# EAGLE design PM_proto_2-alt (EAGLE 9.0.0)
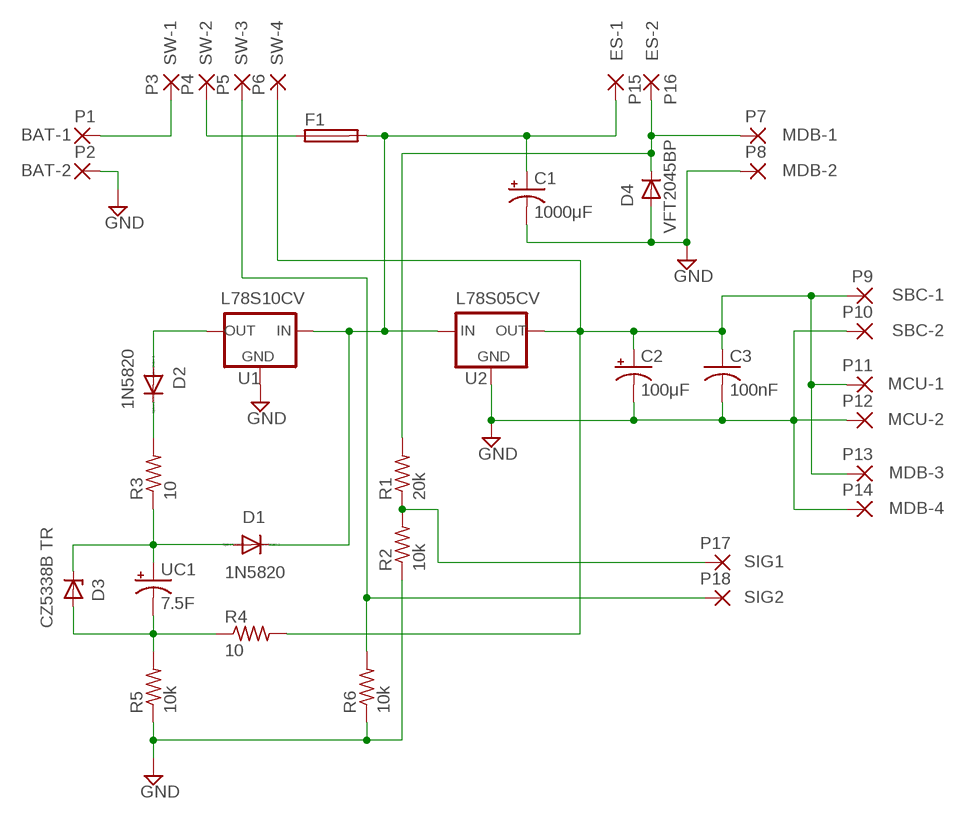
[diagram p0: schematic, sheet 1]

## Parts
C1  1000μF  CPOL-USE7.5-16  [E7,5-16]
C2  100μF  CPOL-USE2,5-6E  [E2,5-6E]
C3  100nF  C-US050-024X044  [C050-024X044]
D1  1N5820  1N4004  [DO41-10]
D2  1N5820  1N4004  [DO41-10]
D3  CZ5338B TR  1N4728  [DO41Z10]
D4  VFT2045BP  [VFT2045BP]
F1  0297015FUSE  [0297015HOLDER]
P1  BAT-1  1,6/0,8  [1,6/0,8]
P2  BAT-2  1,6/0,8  [1,6/0,8]
P3  SW-1  1,6/0,8  [1,6/0,8]
P4  SW-2  1,6/0,8  [1,6/0,8]
P5  SW-3  1,6/0,8  [1,6/0,8]
P6  SW-4  1,6/0,8  [1,6/0,8]
P7  MDB-1  1,6/0,8  [1,6/0,8]
P8  MDB-2  1,6/0,8  [1,6/0,8]
P9  SBC-1  1,6/0,8  [1,6/0,8]
P10  SBC-2  1,6/0,8  [1,6/0,8]
P11  MCU-1  1,6/0,8  [1,6/0,8]
P12  MCU-2  1,6/0,8  [1,6/0,8]
P13  MDB-3  1,6/0,8  [1,6/0,8]
P14  MDB-4  1,6/0,8  [1,6/0,8]
P15  ES-1  1,6/0,8  [1,6/0,8]
P16  ES-2  1,6/0,8  [1,6/0,8]
P17  SIG1  1,6/0,8  [1,6/0,8]
P18  SIG2  1,6/0,8  [1,6/0,8]
R1  20k  R-US_0204/7  [0204/7]
R2  10k  R-US_0204/7  [0204/7]
R3  10  TNP10SC10R0FE  [TNP10SC10R0FE]
R4  10  TNP10SC10R0FE  [TNP10SC10R0FE]
R5  10k  R-US_0204/7  [0204/7]
R6  10k  R-US_0204/7  [0204/7]
U1  L78S10CV  78XXS  [78XXS]
U2  L78S05CV  78XXS  [78XXS]
UC1  7.5F  SCMT32D755MRBB0  [SCMT32D755MRBB0]

## Nets
5VPWR: C2.+ C3.1 P6.1(P) P9.1(P) P11.1(P) P13.1(P) R4.2 U2.OUT
BATT_1: P1.1(P) P3.1(P)
BATT_2: F1.1 F1.2 P4.1(P)
BATT_3: C1.+ D1.C F1.3 F1.4 P15.1(P) U1.IN U2.IN
BATT_4: D4.1(C) P7.1(P) P16.1(P) R1.2
CAP_NEG: D3.A R4.1 R5.2 UC1.2(-)
CAP_POS: D1.A D3.C R3.1 UC1.1(+)
GND: C1.- C2.- C3.2 D4.2(A) P2.1(P) P8.1(P) P10.1(P) P12.1(P) P14.1(P) R2.1 R5.1 R6.1 U1.GND U2.GND
N$2: D2.A U1.OUT
N$3: D2.C R3.2
ON_SENSE: P5.1(P) P18.1(P) R6.2
V_SENSE: P17.1(P) R1.1 R2.2

## Library data of the parts
C1 C2 = rcl:CPOL-US: POLARIZED CAPACITOR, American symbol; SPICEPREFIX: C
C3 = rcl:C-US: CAPACITOR, American symbol; SPICEPREFIX: C
D1 D2 = diode:1N4004: DIODE general purpose rectifier, 1 A
D3 = diode:1N4728: Z DIODE 3.3 V, 1W, 5 percent
D4 = rasm_parts:VFT2045BP: Trench MOS Barrier Schottky Rectifier. 20A 0.51V.
F1 = rasm_parts:0297015FUSE: MINI Blade Fuse 0297xxx
P1-P18 = wirepad:1,6/0,8: THROUGH-HOLE PAD
R1 R2 R5 R6 = rcl:R-US_: RESISTOR, American symbol; SPICEPREFIX: R
R3 R4 = rasm_parts:TNP10SC10R0FE
U1 = v-reg:78XXS: VOLTAGE REGULATOR
U2 = v-reg:78XXS: VOLTAGE REGULATOR; SPICEPREFIX: J
UC1 = rasm_parts:SCMT32D755MRBB0: 5.4V 7.5F supercapacitor/ultracapacitor.

## Board
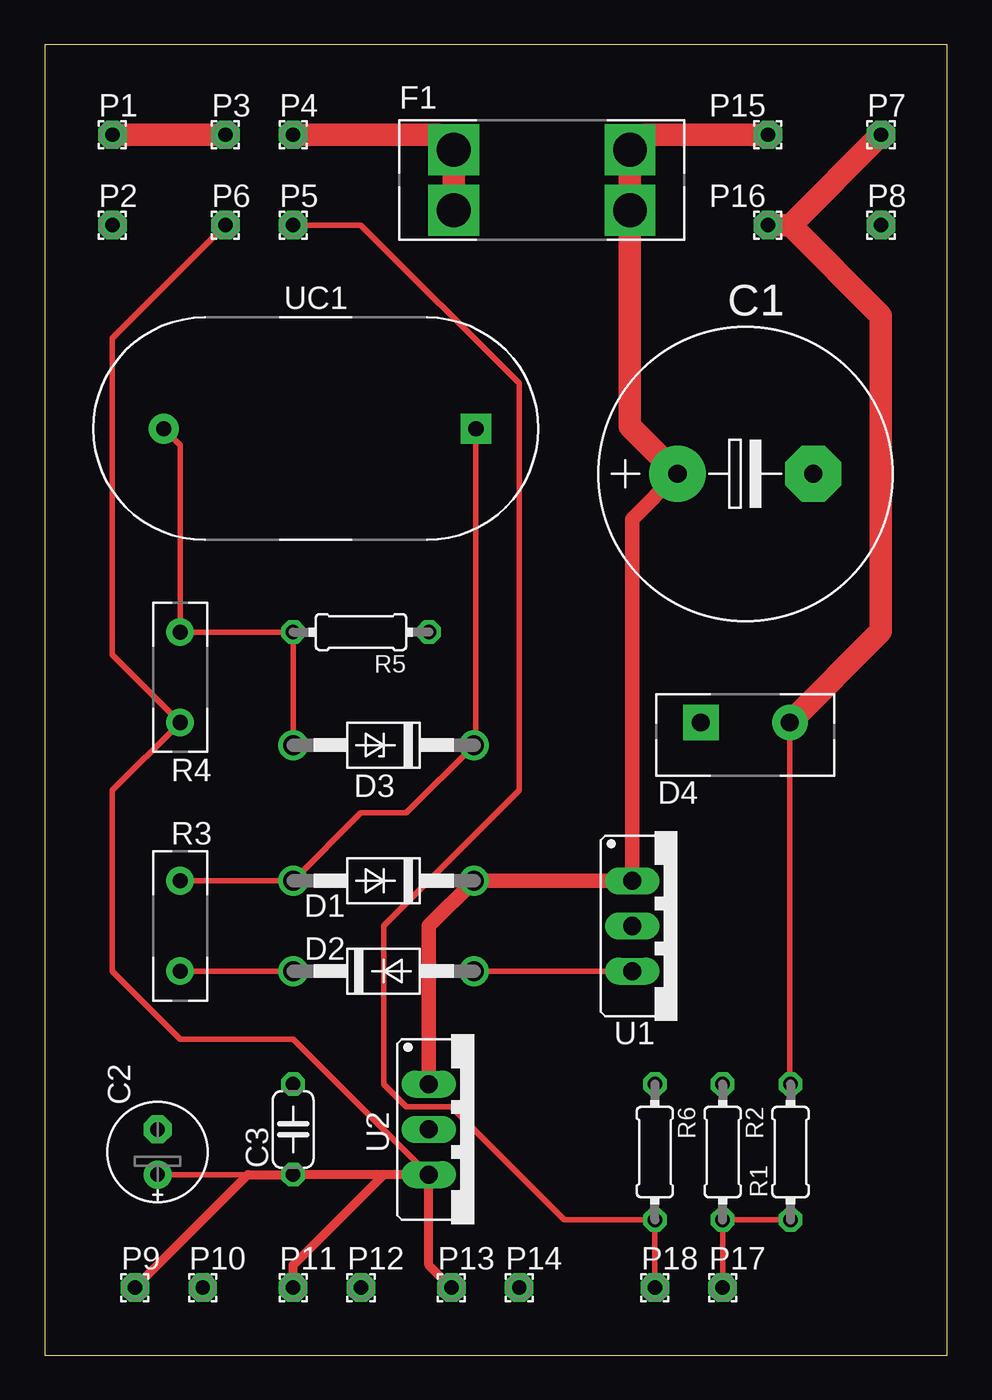
[diagram p1: board, top side]
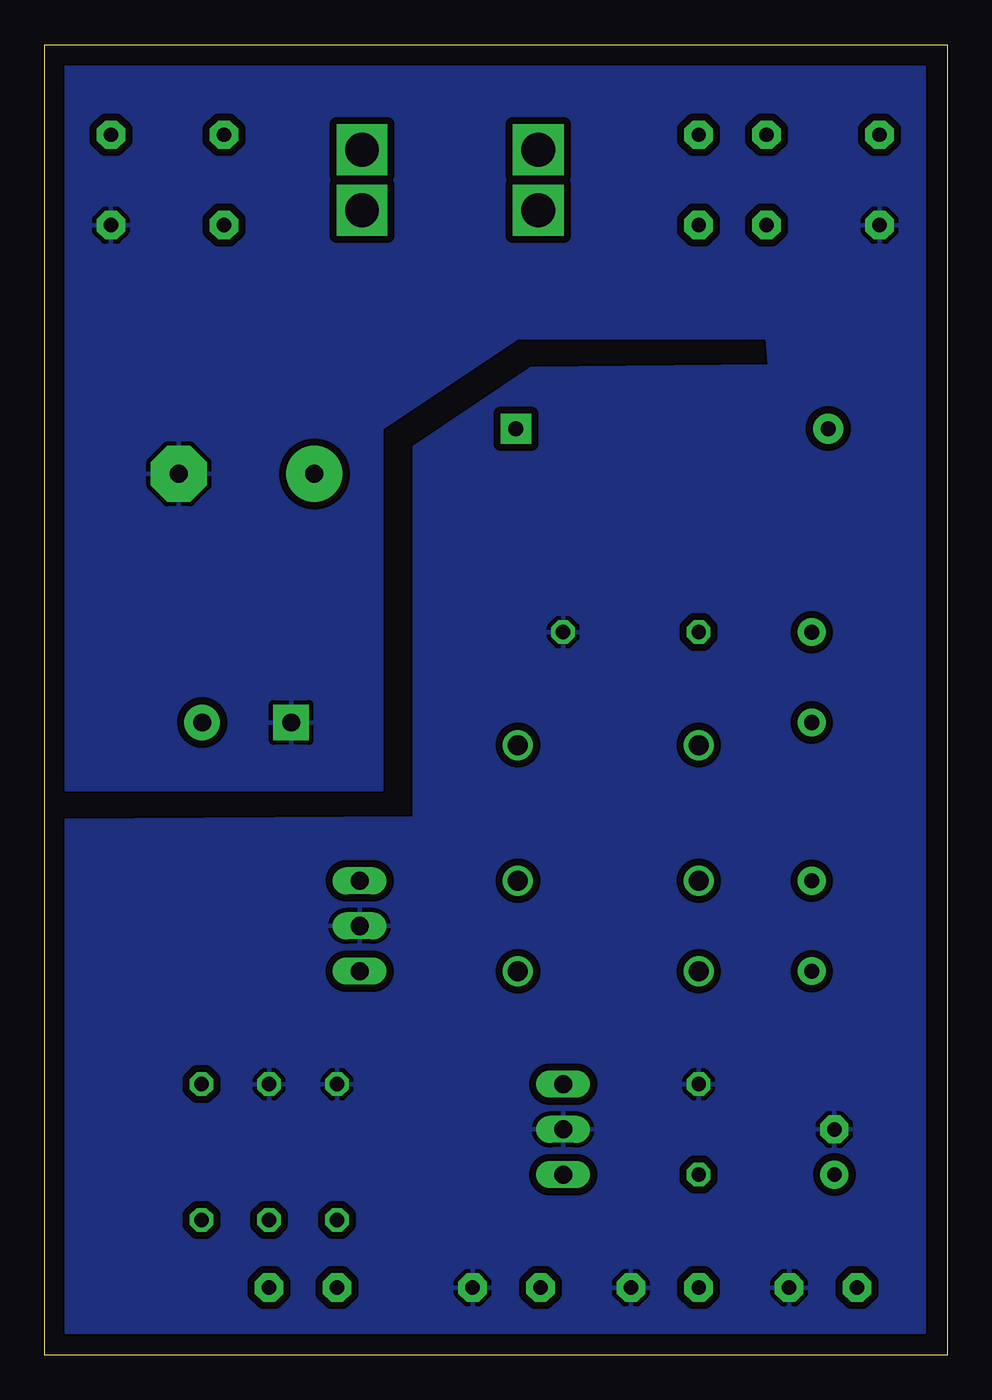
[diagram p2: board, bottom side, seen from below]

Size 50.72 x 73.65 mm. Coordinates in mm from the lower left corner, seen from the top.
Outline: 0,0 50.72,0 50.72,73.65 0,73.65 0,0
Copper layers (1*16): Top 0.035mm / dielectric 1.5mm / Bottom 0.035mm
Design rules "default": minimum track width 6mil, minimum drill 0.35mm, track to track 6mil, track to pad 6mil, pad to pad 6mil, via to via 6mil, smd to smd 6mil, copper to edge 40mil, drill to drill 6mil, minimum pad ring 10mil, minimum via ring 8mil, stop-mask expansion 4mil, vias tented up to drill 0mil, thermal gap 10mil

### Footprints (pad centres in the part's own frame; a part is rotated, then mirrored left to right if it is on the bottom)
E7,5-16 = drill 1.016 pad 3.15: + -3.81,0 | drill 1.016 pad 3.15 octagon: - 3.81,0
E2,5-6E = drill 0.813 pad 1.575: + -1.27,0 | drill 0.813 pad 1.575 octagon: - 1.27,0
C050-024X044 = drill 0.813 octagon: 1 -2.54,0; 2 2.54,0
DO41-10 = drill 1.118: A 5.08,0; C -5.08,0
DO41Z10 = drill 1.118: A 5.08,0; C -5.08,0
VFT2045BP = drill 1 pad 2: 1 -2.5,0 | drill 1 pad 2 square: 2 2.5,0
0297015HOLDER = drill 1.9 pad 2.6 square: 1 -4.95,1.7; 2 -4.95,-1.7; 3 4.95,1.7; 4 4.95,-1.7
1,6/0,8 = drill 0.813 pad 1.6 octagon: 1 0,0
0204/7 = drill 0.813 octagon: 1 -3.81,0; 2 3.81,0
TNP10SC10R0FE = drill 0.85 pad 1.55: 1 -2.54,0; 2 2.54,0
78XXS = drill 1.016 long: GND 0,-2.54; IN -2.54,-2.54; OUT 2.54,-2.54
SCMT32D755MRBB0 = drill 0.85 pad 1.7 square: 1 -9,0 | drill 0.85 pad 1.7: 2 8.54,0

### Placement (x,y rotation side)
C1  39.37,49.53 0 top
C2  6.35,11.43 90 top
C3  13.97,12.7 90 top
D1  19.05,26.67 180 top
D2  19.05,21.59 0 top
D3  19.05,34.29 180 top
D4  39.37,35.56 180 top
F1  27.94,66.04 0 top
P1  3.81,68.58 0 top
P2  3.81,63.5 0 top
P3  10.16,68.58 0 top
P4  13.97,68.58 0 top
P5  13.97,63.5 0 top
P6  10.16,63.5 0 top
P7  46.99,68.58 0 top
P8  46.99,63.5 0 top
P9  5.08,3.81 0 top
P10  8.89,3.81 0 top
P11  13.97,3.81 0 top
P12  17.78,3.81 0 top
P13  22.86,3.81 0 top
P14  26.67,3.81 0 top
P15  40.64,68.58 0 top
P16  40.64,63.5 0 top
P17  38.1,3.81 0 top
P18  34.29,3.81 0 top
R1  41.91,11.43 90 top
R2  38.1,11.43 270 top
R3  7.62,24.13 270 top
R4  7.62,38.1 270 top
R5  17.78,40.64 180 top
R6  34.29,11.43 270 top
U1  35.56,24.13 270 top
U2  24.13,12.7 270 top
UC1  15.24,52.07 180 top

### Tracks (layer width: path | path; a pad name or v marks a point on that pad's centre or on a via)
5VPWR
  Top 0.305: P6.1 3.81,57.15 3.81,39.37 R4.2 3.81,31.75 3.81,21.59 7.62,17.78 13.97,17.78 U2.OUT | C2.+ 11.43,10.16
  Top 0.508: 19.05,10.16 U2.OUT 21.59,5.08 P13.1 | 19.05,10.16 C3.1 11.43,10.16 P9.1 | P11.1 13.97,5.08 19.05,10.16
BATT_1
  Top 1.27: P3.1 P1.1
BATT_2
  Top 1.27: F1.2 F1.1 22.15,68.58 P4.1
BATT_3
  Top 0.305: F1.4 32.89,63.37
  Top 0.813: C1.+ 33.02,46.99 U1.IN D1.C 21.59,24.13 U2.IN
  Top 1.27: P15.1 33.73,68.58 F1.3 F1.4 32.89,52.2 C1.+
BATT_4
  Top 0.305: D4.1 41.87,15.28 R1.2
  Top 1.27: D4.1 46.99,40.68 46.99,58.42 41.91,63.5 | P7.1 41.91,63.5 | 41.91,63.5 P16.1
CAP_NEG
  Top 0.305: D3.A R5.2 R4.1 7.62,51.15 UC1.2
CAP_POS
  Top 0.305: R3.1 D1.A 17.78,30.48 20.32,30.48 D3.C 24.24,34.4 UC1.1
GND
  pour Bottom (isolate 0.406): 1.27,72.39 49.53,72.39 49.53,31.75 31.75,31.75 31.75,52.07 24.13,57.15 10.16,57.15 10.03,55.63 23.37,55.5 29.97,51.05 29.97,30.23 49.53,30.1 49.53,1.27 1.27,1.27
N$2
  Top 0.305: D2.A U1.OUT
N$3
  Top 0.305: R3.2 D2.C
ON_SENSE
  Top 0.305: R6.2 P18.1 | R6.2 34.29,6.35 | P5.1 17.78,63.5 26.67,54.61 26.67,31.75 19.05,24.13 19.05,15.24 20.32,13.97 22.86,13.97 29.21,7.62 R6.2
V_SENSE
  Top 0.305: P17.1 R2.2 R1.1